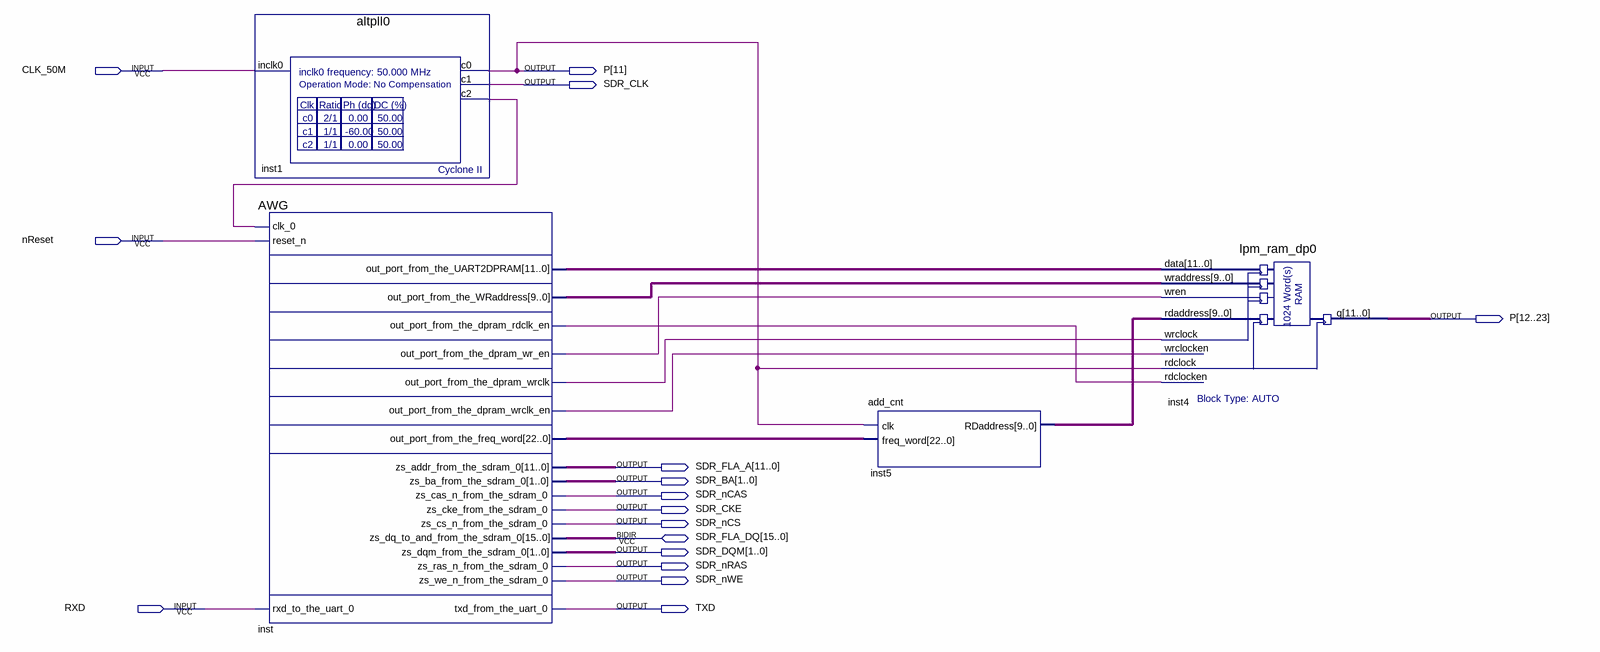
[diagram p0: schematic sheet]
// Quartus schematic TopDsn.bdf as structural Verilog: 4 symbols, 16 pins
module TopDsn (
  input  CLK_50M,
  input  nReset,
  input  RXD,
  inout  [15:0] SDR_FLA_DQ,
  output [11:23] P,
  output SDR_CLK,
  output [11:0] SDR_FLA_A,
  output [1:0] SDR_BA,
  output SDR_nCAS,
  output SDR_CKE,
  output SDR_nCS,
  output [1:0] SDR_DQM,
  output SDR_nRAS,
  output SDR_nWE,
  output TXD
);

  wire inst1_c2, inst_out_port_from_the_dpram_rdclk_en, inst_out_port_from_the_dpram_wr_en,
       inst_out_port_from_the_dpram_wrclk, inst_out_port_from_the_dpram_wrclk_en;
  wire [9:0] inst5_rdaddress, inst_out_port_from_the_wraddress;
  wire [11:0] inst_out_port_from_the_uart2dpram;
  wire [22:0] inst_out_port_from_the_freq_word;

  altpll0 inst1 (.inclk0(CLK_50M), .c0(P[11]), .c1(SDR_CLK), .c2(inst1_c2));
  AWG inst (
    .clk_0(inst1_c2), .reset_n(nReset), .rxd_to_the_uart_0(RXD),
    .out_port_from_the_UART2DPRAM(inst_out_port_from_the_uart2dpram),
    .out_port_from_the_WRaddress(inst_out_port_from_the_wraddress),
    .out_port_from_the_dpram_rdclk_en(inst_out_port_from_the_dpram_rdclk_en),
    .out_port_from_the_dpram_wr_en(inst_out_port_from_the_dpram_wr_en),
    .out_port_from_the_dpram_wrclk(inst_out_port_from_the_dpram_wrclk),
    .out_port_from_the_dpram_wrclk_en(inst_out_port_from_the_dpram_wrclk_en),
    .out_port_from_the_freq_word(inst_out_port_from_the_freq_word), .zs_addr_from_the_sdram_0(SDR_FLA_A),
    .zs_ba_from_the_sdram_0(SDR_BA), .zs_cas_n_from_the_sdram_0(SDR_nCAS), .zs_cke_from_the_sdram_0(SDR_CKE),
    .zs_cs_n_from_the_sdram_0(SDR_nCS), .zs_dqm_from_the_sdram_0(SDR_DQM),
    .zs_ras_n_from_the_sdram_0(SDR_nRAS), .zs_we_n_from_the_sdram_0(SDR_nWE), .txd_from_the_uart_0(TXD),
    .zs_dq_to_and_from_the_sdram_0(SDR_FLA_DQ));
  add_cnt inst5 (.clk(P[11]), .freq_word(inst_out_port_from_the_freq_word), .RDaddress(inst5_rdaddress));
  lpm_ram_dp0 inst4 (
    .data(inst_out_port_from_the_uart2dpram), .wraddress(inst_out_port_from_the_wraddress),
    .wren(inst_out_port_from_the_dpram_wr_en), .rdaddress(inst5_rdaddress),
    .wrclock(inst_out_port_from_the_dpram_wrclk), .wrclocken(inst_out_port_from_the_dpram_wrclk_en),
    .rdclock(P[11]), .rdclocken(inst_out_port_from_the_dpram_rdclk_en), .q(P[12:23]));
endmodule
